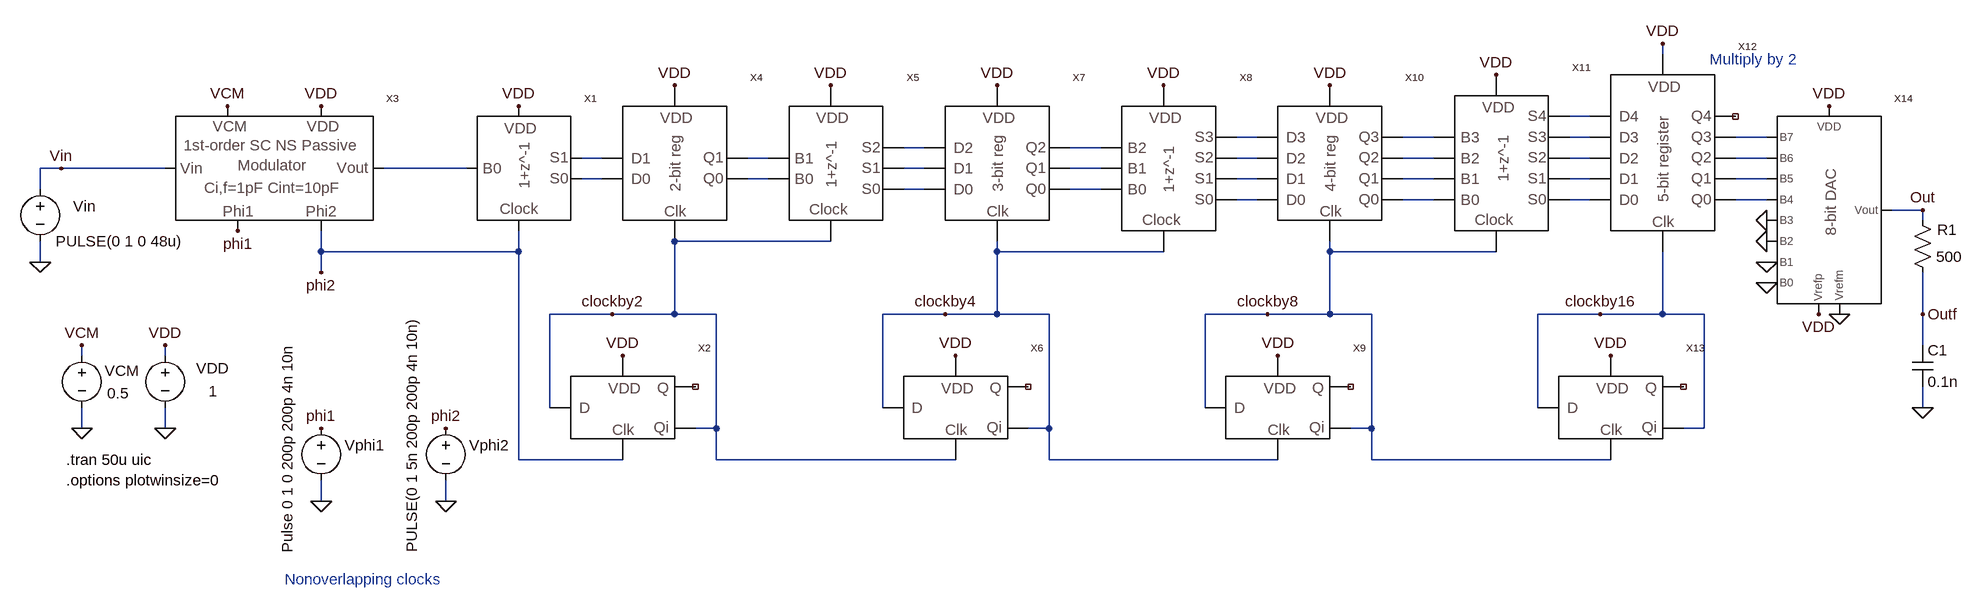
[diagram p0: schematic _Fig6_16_SC_MSD.asc]
_Fig6_16_SC_MSD.asc, the LTspice schematic file:
Version 4
SHEET 1 3504 680
WIRE 2544 -400 2544 -416
WIRE 2432 -304 2400 -304
WIRE 1920 -272 1888 -272
WIRE 2192 -272 2144 -272
WIRE 2432 -272 2400 -272
WIRE 2704 -272 2656 -272
WIRE 1408 -256 1376 -256
WIRE 1680 -256 1632 -256
WIRE 912 -240 880 -240
WIRE 1168 -240 1136 -240
WIRE 1920 -240 1888 -240
WIRE 2192 -240 2144 -240
WIRE 2432 -240 2400 -240
WIRE 2704 -240 2656 -240
WIRE 80 -224 48 -224
WIRE 240 -224 80 -224
WIRE 704 -224 576 -224
WIRE 1408 -224 1376 -224
WIRE 1680 -224 1632 -224
WIRE 912 -208 880 -208
WIRE 1168 -208 1136 -208
WIRE 1920 -208 1888 -208
WIRE 2192 -208 2144 -208
WIRE 2432 -208 2400 -208
WIRE 2704 -208 2656 -208
WIRE 48 -192 48 -224
WIRE 1408 -192 1376 -192
WIRE 1680 -192 1632 -192
WIRE 1920 -176 1888 -176
WIRE 2192 -176 2144 -176
WIRE 2432 -176 2400 -176
WIRE 2704 -176 2656 -176
WIRE 2944 -160 2896 -160
WIRE 2944 -144 2944 -160
WIRE 1264 -112 1024 -112
WIRE 480 -96 480 -128
WIRE 784 -96 784 -128
WIRE 784 -96 480 -96
WIRE 1520 -96 1520 -112
WIRE 1776 -96 1520 -96
WIRE 2032 -96 2032 -112
WIRE 2288 -96 2032 -96
WIRE 48 -80 48 -112
WIRE 480 -64 480 -96
WIRE 928 0 832 0
WIRE 1024 0 1024 -112
WIRE 1024 0 928 0
WIRE 1088 0 1024 0
WIRE 1440 0 1344 0
WIRE 1520 0 1520 -96
WIRE 1520 0 1440 0
WIRE 1600 0 1520 0
WIRE 1936 0 1840 0
WIRE 2032 0 2032 -96
WIRE 2032 0 1936 0
WIRE 2096 0 2032 0
WIRE 2448 0 2352 0
WIRE 2544 0 2544 -96
WIRE 2544 0 2448 0
WIRE 2608 0 2544 0
WIRE 2944 0 2944 -64
WIRE 2944 48 2944 0
WIRE 112 64 112 48
WIRE 240 64 240 48
WIRE 832 144 832 0
WIRE 1344 144 1344 0
WIRE 1840 144 1840 0
WIRE 2352 144 2352 0
WIRE 2944 144 2944 112
WIRE 112 176 112 144
WIRE 240 176 240 144
WIRE 1088 176 1088 0
WIRE 1088 176 1056 176
WIRE 1600 176 1600 0
WIRE 1600 176 1568 176
WIRE 2096 176 2096 0
WIRE 2096 176 2064 176
WIRE 2608 176 2608 0
WIRE 2608 176 2576 176
WIRE 784 224 784 -96
WIRE 944 224 784 224
WIRE 1088 224 1088 176
WIRE 1456 224 1088 224
WIRE 1600 224 1600 176
WIRE 1952 224 1600 224
WIRE 2096 224 2096 176
WIRE 2464 224 2096 224
WIRE 480 288 480 256
WIRE 672 288 672 256
FLAG 240 176 0
FLAG 480 -320 VDD
FLAG 240 48 VDD
FLAG 112 176 0
FLAG 112 48 VCM
FLAG 48 -80 0
FLAG 80 -224 Vin
FLAG 784 -320 VDD
FLAG 944 64 VDD
FLAG 928 0 clockby2
FLAG 1024 -352 VDD
FLAG 1264 -352 VDD
FLAG 1456 64 VDD
FLAG 1440 0 clockby4
FLAG 1520 -352 VDD
FLAG 1776 -352 VDD
FLAG 1952 64 VDD
FLAG 1936 0 clockby8
FLAG 2032 -352 VDD
FLAG 2288 -368 VDD
FLAG 2464 64 VDD
FLAG 2448 0 clockby16
FLAG 2544 -416 VDD
FLAG 2800 -320 VDD
FLAG 2784 0 VDD
FLAG 2816 0 0
FLAG 2704 -80 0
FLAG 2704 -48 0
FLAG 2944 -160 Out
FLAG 2944 144 0
FLAG 2944 0 Outf
FLAG 2704 -112 0
FLAG 2704 -144 0
FLAG 480 288 0
FLAG 480 176 phi1
FLAG 672 288 0
FLAG 672 176 phi2
FLAG 352 -128 phi1
FLAG 480 -64 phi2
FLAG 336 -320 VCM
SYMBOL voltage 240 48 R0
WINDOW 0 48 35 Left 0
WINDOW 3 67 71 Left 0
SYMATTR InstName VDD
SYMATTR Value 1
SYMBOL voltage 112 48 R0
WINDOW 0 35 39 Left 0
WINDOW 3 39 74 Left 0
SYMATTR InstName VCM
SYMATTR Value 0.5
SYMBOL voltage 48 -208 R0
WINDOW 0 51 42 Left 0
WINDOW 123 0 0 Left 0
WINDOW 39 0 0 Left 0
SYMATTR InstName Vin
SYMATTR Value PULSE(0 1 0 48u)
SYMBOL 1_bit_averager 720 -144 R0
SYMATTR InstName X1
SYMBOL DFF 864 192 R0
SYMATTR InstName X2
SYMBOL 2_bit_register 944 -144 R0
SYMATTR InstName X4
SYMBOL 2_bit_averager 1200 -144 R0
SYMATTR InstName X5
SYMBOL DFF 1376 192 R0
SYMATTR InstName X6
SYMBOL 3_bit_register 1440 -144 R0
SYMATTR InstName X7
SYMBOL 3_bit_averager 1712 -128 R0
SYMATTR InstName X8
SYMBOL DFF 1872 192 R0
SYMATTR InstName X9
SYMBOL 4_bit_register 1952 -144 R0
SYMATTR InstName X10
SYMBOL 4_bit_averager 2224 -128 R0
SYMATTR InstName X11
SYMBOL 5_bit_register 2464 -128 R0
SYMATTR InstName X12
SYMBOL DFF 2384 192 R0
SYMATTR InstName X13
SYMBOL Ideal_8_bit_DAC 2720 -16 R0
SYMATTR InstName X14
SYMBOL res 2960 -48 R180
WINDOW 0 -37 82 Left 0
WINDOW 3 -45 40 Left 0
SYMATTR InstName R1
SYMATTR Value 500
SYMBOL cap 2928 48 R0
SYMATTR InstName C1
SYMATTR Value 0.1n
SYMBOL voltage 480 160 R0
WINDOW 0 36 42 Left 0
WINDOW 3 -52 207 VLeft 0
WINDOW 123 0 0 Left 0
WINDOW 39 0 0 Left 0
SYMATTR InstName Vphi1
SYMATTR Value Pulse 0 1 0 200p 200p 4n 10n
SYMBOL voltage 672 160 R0
WINDOW 0 36 42 Left 0
WINDOW 3 -52 207 VLeft 0
WINDOW 123 0 0 Left 0
WINDOW 39 0 0 Left 0
SYMATTR InstName Vphi2
SYMATTR Value PULSE(0 1 5n 200p 200p 4n 10n)
SYMBOL 1_bit_1st_PNS_SCmod_MSD 256 -144 R0
SYMATTR InstName X3
TEXT 88 224 Left 0 !.tran 50u uic
TEXT 88 256 Left 0 !.options plotwinsize=0
TEXT 2616 -392 Left 0 ;Multiply by 2
TEXT 424 408 Left 0 ;Nonoverlapping clocks

The netlist it stands for:
* _Fig6_16_SC_MSD.asc
VDD VDD 0 1
VCM VCM 0 0.5
Vin Vin 0 PULSE(0 1 0 48u)
XX1 N014 N017 N008 phi2 VDD 1_bit_averager  ; pins B0 S0 S1 Clock VDD
XX2 clockby2 phi2 NC_01 clockby2 VDD DFF  ; pins D Clk Q Qi VDD
XX4 N017 N008 N018 N009 clockby2 VDD 2_bit_register  ; pins D0 D1 Q0 Q1 Clk VDD
XX5 N018 N009 N023 N015 N006 clockby2 VDD 2_bit_averager  ; pins B0 B1 S0 S1 S2 Clock VDD
XX6 clockby4 clockby2 NC_02 clockby4 VDD DFF  ; pins D Clk Q Qi VDD
XX7 N023 N015 N006 N024 N016 N007 clockby4 VDD 3_bit_register  ; pins D0 D1 D2 Q0 Q1 Q2 Clk VDD
XX8 N024 N016 N007 N025 N019 N010 N002 clockby4 VDD 3_bit_averager  ; pins B0 B1 B2 S0 S1 S2 S3 Clock VDD
XX9 clockby8 clockby4 NC_03 clockby8 VDD DFF  ; pins D Clk Q Qi VDD
XX10 N025 N019 N010 N002 N026 N020 N011 N003 clockby8 VDD 4_bit_register  ; pins D0 D1 D2 D3 Q0 Q1 Q2 Q3 Clk VDD
XX11 N026 N020 N011 N003 N027 N021 N012 N004 N001 clockby8 VDD 4_bit_averager  ; pins B0 B1 B2 B3 S0 S1 S2 S3 S4 Clock VDD
XX12 N027 N021 N012 N004 N001 N028 N022 N013 N005 NC_04 clockby16 VDD 5_bit_register  ; pins D0 D1 D2 D3 D4 Q0 Q1 Q2 Q3 Q4 Clk VDD
XX13 clockby16 clockby8 NC_05 clockby16 VDD DFF  ; pins D Clk Q Qi VDD
XX14 N005 N013 N022 N028 0 0 0 0 Out VDD 0 VDD Ideal_8_bit_DAC  ; pins B7 B6 B5 B4 B3 B2 B1 B0 Vout Vrefp Vrefm VDD
R1 Outf Out 500
C1 Outf 0 0.1n
Vphi1 phi1 0 Pulse 0 1 0 200p 200p 4n 10n
Vphi2 phi2 0 PULSE(0 1 5n 200p 200p 4n 10n)
XX3 Vin VDD N014 phi1 VCM phi2 1_bit_1st_PNS_SCmod_MSD  ; pins Vin VDD Vout phi1 VCM phi2
.tran 50u uic
.options plotwinsize=0
* Multiply by 2
* Nonoverlapping clocks
.backanno
.end